# Altium schematic sheet System_Power.SchDoc
size A3; SheetNumber: 2; SheetTotal: 8
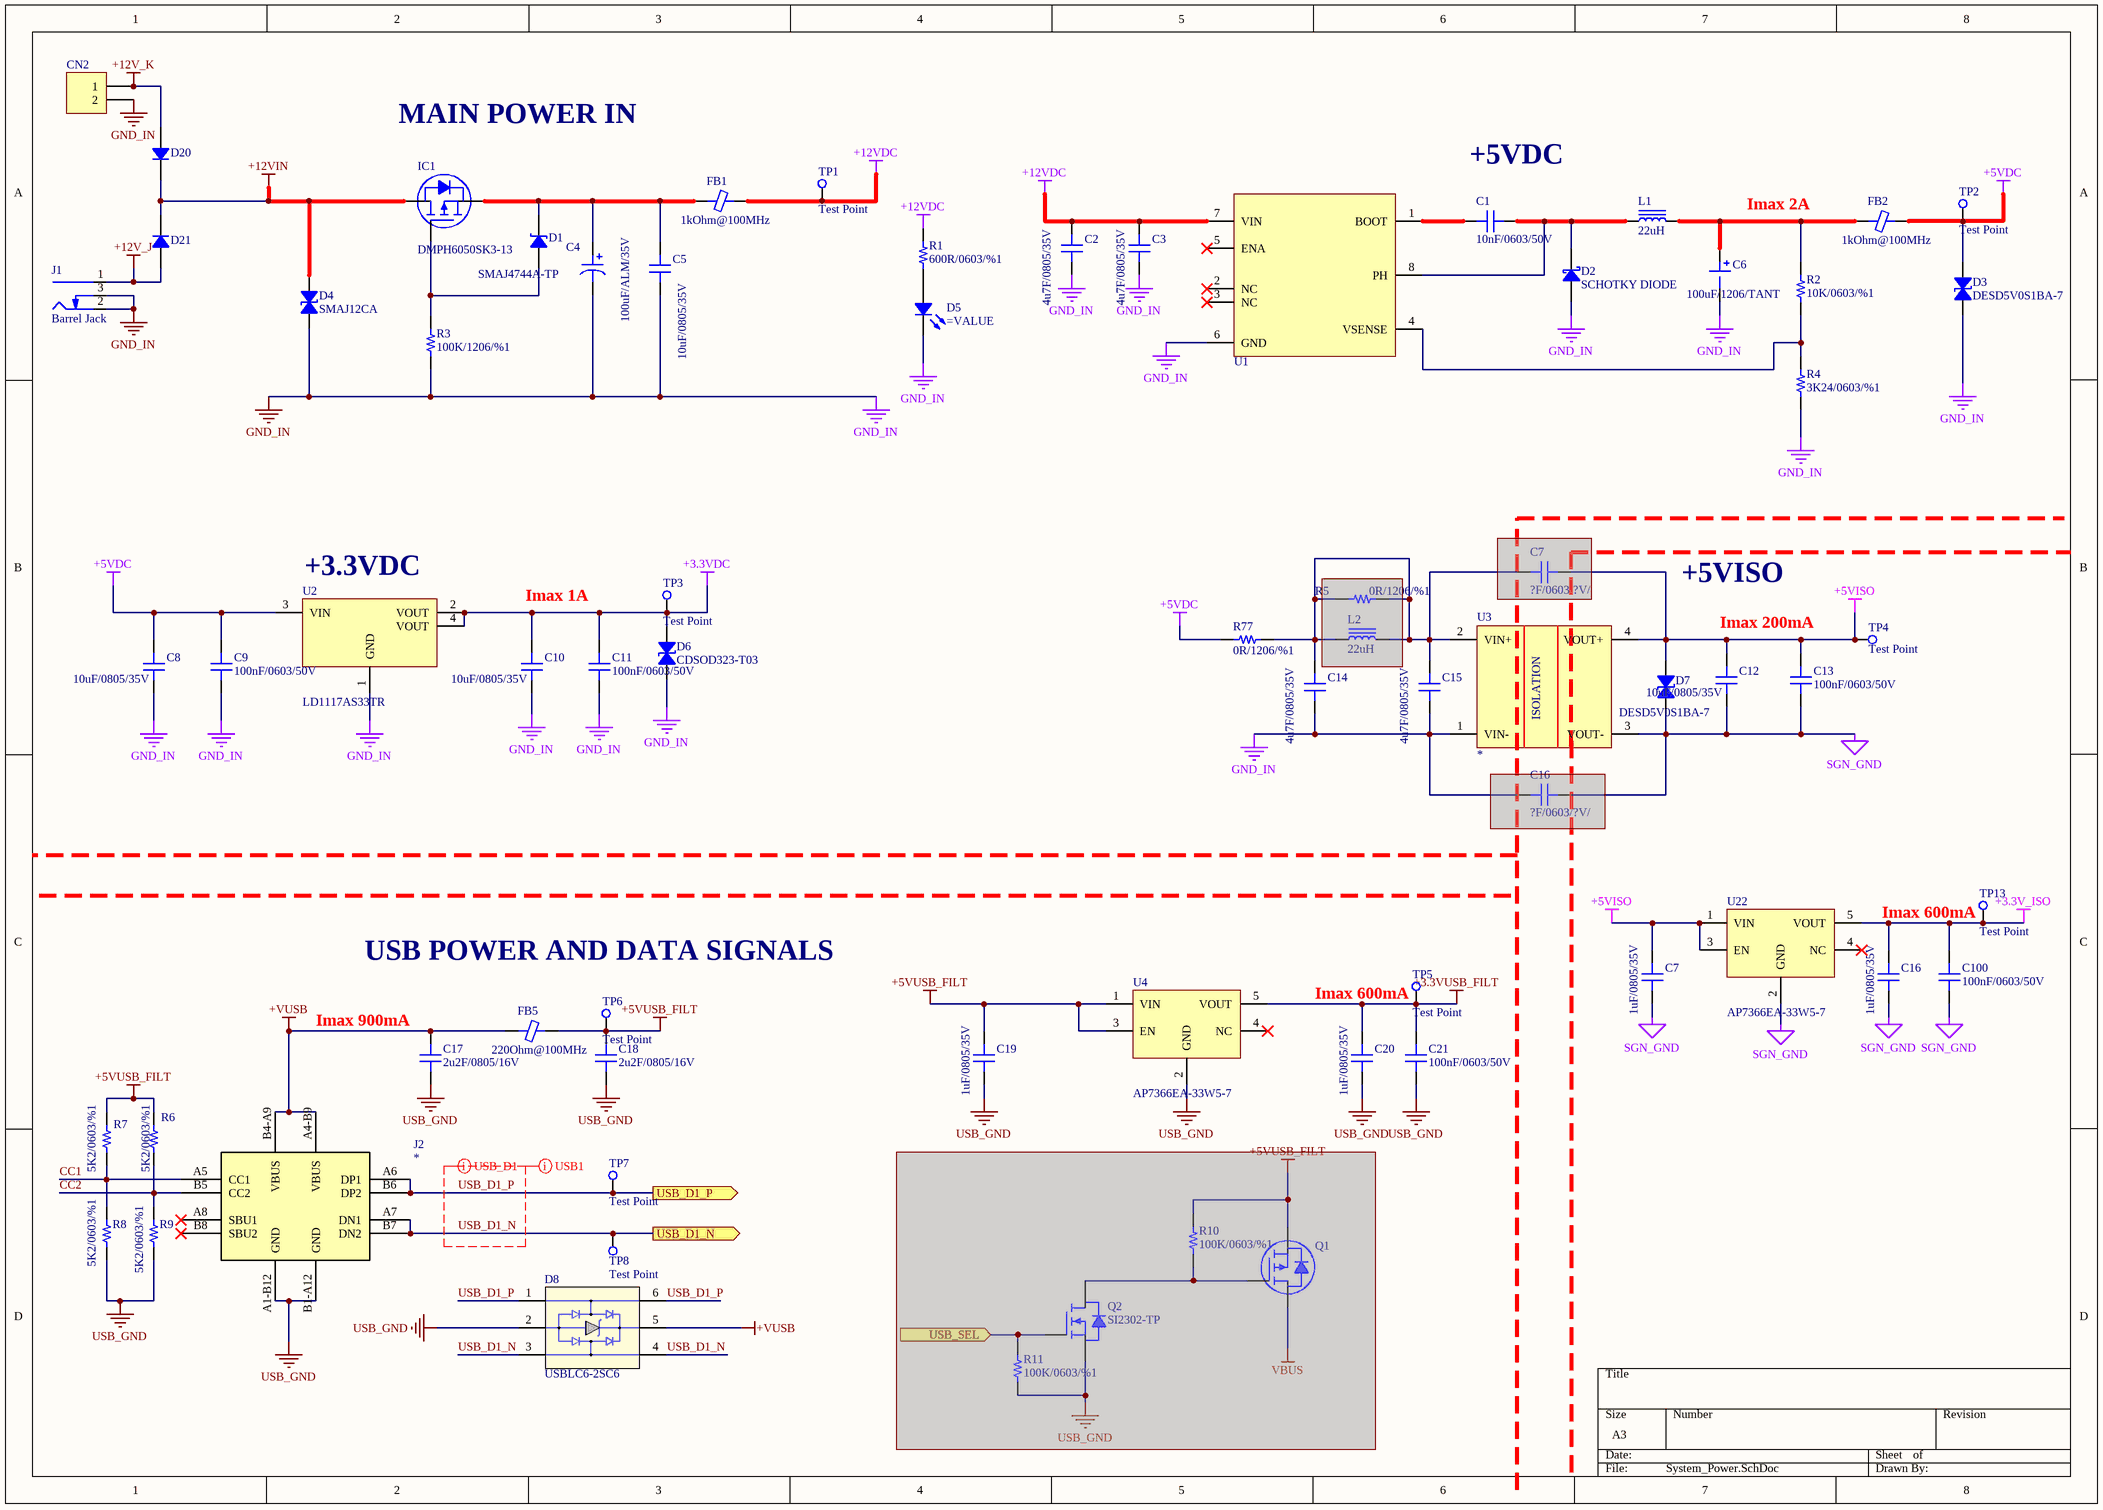
[diagram p0: System_Power.SchDoc]

## Parts
(Parts that share a designator on the sheet are numbered #1, #2 ... from top to bottom, then left to right.)
C1  10nF/0603/50V  [0603_cap]
C2  4u7F/0805/35V  [0805_cap]
C3  4u7F/0805/35V  [0805_cap]
C4  100uF/ALM/35V  [CAP ALSMD 6.6MM]
C5  10uF/0805/35V  [0805_cap]
C6  100uF/1206/TANT  [CAP POL 1206_3216]
C7#1  ?F/0603/?V/  [0402_cap]  (masked out: inside a compile mask, not in the netlist)
C7#2  1uF/0805/35V  [0805_cap]
C8  10uF/0805/35V  [0805_cap]
C9  100nF/0603/50V  [0603_cap]
C10  10uF/0805/35V  [0805_cap]
C11  100nF/0603/50V  [0603_cap]
C12  10uF/0805/35V  [0805_cap]
C13  100nF/0603/50V  [0603_cap]
C14  4u7F/0805/35V  [0805_cap]
C15  4u7F/0805/35V  [0805_cap]
C16#1  ?F/0603/?V/  [0402_cap]  (masked out: inside a compile mask, not in the netlist)
C16#2  1uF/0805/35V  [0805_cap]
C17  2u2F/0805/16V  [0805_cap]
C18  2u2F/0805/16V  [0805_cap]
C19  1uF/0805/35V  [0805_cap]
C20  1uF/0805/35V  [0805_cap]
C21  100nF/0603/50V  [0603_cap]
C100  100nF/0603/50V  [0603_cap]
CN2  DG128-5.0-02P-14-00AH  [klemens]  (value not drawn)
D1  SMAJ4744A-TP  [SOD323]
D2  SCHOTKY DIODE  [DO214AC SMA]
D3  DESD5V0S1BA-7  [SOD323]
D4  SMAJ12CA  [SOD323]
D5  (no value)  [LED 0603_1608 GREEN]
D6  CDSOD323-T03  [SOD323]
D7  DESD5V0S1BA-7  [SOD323]
D8  USBLC6-2SC6  [TI SOT-23-6 DBV]
D20  (no value)  [DO214AC SMA]
D21  (no value)  [DO214AC SMA]
FB1  1kOhm@100MHz  [0805_ferrite]
FB2  1kOhm@100MHz  [0805_ferrite]
FB5  220Ohm@100MHz  [0805_ferrite]
IC1  DMPH6050SK3-13  [TO 252]
J1  Barrel Jack  [CUI_PJ-002B]
J2  *  [USB4105_GCT]
L1  22uH  [IND(8.00mm x 8.00mm)]
L2  22uH  [IND(8.00mm x 8.00mm)]  (masked out: inside a compile mask, not in the netlist)
Q1  (no value)  [TI SOT-23-3 DBZ]  (masked out: inside a compile mask, not in the netlist)
Q2  SI2302-TP  [TI SOT-23-3 DBZ]  (masked out: inside a compile mask, not in the netlist)
R1  600R/0603/%1  [0603_res]
R2  10K/0603/%1  [0603_res]
R3  100K/1206/%1  [1206_res]
R4  3K24/0603/%1  [0603_res]
R5  0R/1206/%1  [1206_res]  (masked out: inside a compile mask, not in the netlist)
R6  5K2/0603/%1  [0603_res]
R7  5K2/0603/%1  [0603_res]
R8  5K2/0603/%1  [0603_res]
R9  5K2/0603/%1  [0603_res]
R10  100K/0603/%1  [0603_res]  (masked out: inside a compile mask, not in the netlist)
R11  100K/0603/%1  [0603_res]  (masked out: inside a compile mask, not in the netlist)
R77  0R/1206/%1  [0603_res]
TP1  Test Point  [tp]
TP2  Test Point  [tp]
TP3  Test Point  [tp]
TP4  Test Point  [tp]
TP5  Test Point  [tp]
TP6  Test Point  [tp]
TP7  Test Point  [tp]
TP8  Test Point  [tp]
TP13  Test Point  [tp]
U1  *  [SOIC-8(3.90MM)]  (value not drawn)
U2  LD1117AS33TR  [SOT-223]
U3  *  [SIP4]
U4  AP7366EA-33W5-7  [SOT25]
U22  AP7366EA-33W5-7  [SOT25]

## Ports
USB_D1_N (out, see Main[2A], USB_Isolation[1D]), USB_D1_P (out, see Main[2A], USB_Isolation[1D]), USB_SEL (in, see Main[2A], USB_Isolation[2A])

## Nets
+3.3V_ISO: C16#2.2 C100.2 TP13.1(TP) U22.5(VOUT)
+3.3VDC: C10.2 C11.2 D6.2 TP3.1(TP) U2.2(VOUT) U2.4(VOUT)
+3.3VUSB_FILT: C20.2 C21.2 TP5.1(TP) U4.5(VOUT)
+5VDC: C8.2 C9.2 D3.2 FB2.2 R77.2 TP2.1(TP) U2.3(VIN)
+5VISO: C7#2.2 C12.2 C13.2 D7.2 TP4.1(TP) U3.4(VOUT+) U22.1(VIN) U22.3(EN)
+5VUSB_FILT: C18.2 C19.2 FB5.2 R6.2 R7.2 TP6.1(TP) U4.1(VIN) U4.3(EN)
+12V_J: D21.1 J1.1(Centre)
+12V_K: CN2.1 D20.1
+12VDC: C2.2 C3.2 FB1.2 R1.2 TP1.1(TP) U1.7(VIN)
+12VIN: D4.2 D20.2 D21.2 IC1.D
+VUSB: C17.2 D8.5 FB5.1 J2.A4-B9(VBUS) J2.B4-A9(VBUS)
GND_IN: C2.1 C3.1 C4.1 C5.1 C6.2 C8.1 C9.1 C10.1 C11.1 C14.1 C15.1 CN2.2 D2.2 D3.1 D4.1 D5.2 D6.1 J1.2(Outer) J1.3(SW) R3.1 R4.1 U1.6(GND) U2.1(GND) U3.1(VIN-)
SGN_GND: C7#2.1 C12.1 C13.1 C16#2.1 C100.1 D7.1 U3.3(VOUT-) U22.2(GND)
USB_GND: C17.1 C18.1 C19.1 C20.1 C21.1 D8.2 J2.A1-B12(GND) J2.B1-A12(GND) R8.1 R9.1 U4.2(GND)
CC1: J2.A5(CC1) R7.1 R8.2
CC2: J2.B5(CC2) R6.1 R9.2
USB_D1_N: D8.3 D8.4 J2.A7(DN1) J2.B7(DN2) TP8.1(TP) ; port USB_D1_N
USB_D1_P: D8.1 D8.6 J2.A6(DP1) J2.B6(DP2) TP7.1(TP) ; port USB_D1_P
NetC1_1: C1.1 D2.1 L1.1 U1.8(PH)
NetC1_2: C1.2 U1.1(BOOT)
NetC4_2: C4.2 C5.2 D1.2 FB1.1 IC1.S
NetC6_1: C6.1 FB2.1 L1.2 R2.2
NetC14_2: C14.2 C15.2 R77.1 U3.2(VIN+)
NetD1_1: D1.1 IC1.G R3.2
NetD5_1: D5.1 R1.1
NetR2_1: R2.1 R4.2 U1.4(VSENSE)

Not connected (* = marked no-connect by the designer): J2 A8(SBU1)* B8(SBU2)*; U1 2(NC)* 3(NC)* 5(ENA)*; U4 4(NC)*; U22 4(NC)*

## Layout directives
mark named USB1: USB_D1_N, USB_D1_P
differential pair: USB_D1_N, USB_D1_P

## Notes on the sheet
- MAIN POWER IN
- (near C1) +5VDC
- Imax 2A
- (near U2) +3.3VDC
- +5VISO
- Imax 1A
- Imax 200mA
- (near TP13) Imax 600mA
- USB POWER AND DATA SIGNALS
- (near C17) Imax 900mA
- (near TP5) Imax 600mA
- (in symbol RFM-0505S) ISOLATION

## Library data of the parts
C1-C3 C5 C7#1 C7#2 C8-C15 C16#1 C16#2 C17-C21 C100 = Capacitor: HelpURL: *; PN: *; Assembly: *
  C1: Value: 10nF/0603/50V
  C2 C3 C14 C15: Value: 4u7F/0805/35V
  C5 C8 C10 C12: Value: 10uF/0805/35V
  C7#1 C16#1: Value: ?F/0603/?V/
  C7#2 C16#2 C19 C20: Value: 1uF/0805/35V
  C9 C11 C13 C21 C100: Value: 100nF/0603/50V
  C17 C18: Value: 2u2F/0805/16V
C4 = Polarised Capacitor IPC: SMT Polarised Capacitor
C6 = tantalcap: MFC PN: TLJA107M010R1400; Assembly: *; Help URL: *; Manufacturer: *; Value: 100uF/1206/TANT
CN2 = klemens_2p: Value: DG128-5.0-02P-14-00AH; Parameter 2: DG128-5.0-02P-14-00AH; Parameter 3: DG128-5.0-02P-14-00AH
D1 = Diode Zener: Zener Diode; Assembly: .; Value: SMAJ4744A-TP; HelpURL: https://www.digikey.com/en/products/detail/mcc-micro-commercial-components/SMAJ4744A-TP/950471?s=N4IgTCBcDaIMoFkCCApALAdjWpBaAKgAogC6AvkA; PN: SMAJ4744A-TP
D2 = SCHOTKY DIODE: Value: B340AE-13; Assembly: .; PN: B340AE-13; HelpURL: https://www.digikey.com/en/products/detail/diodes-incorporated/B340AE-13/7352831
D3 D4 D6 D7 = TVS BI: Zener Diode; Assembly: .
  D3 D7: HelpURL: https://www.digikey.com/en/products/detail/diodes-incorporated/DESD5V0S1BA-7/3451477?s=N4IgTCBcDaICIFEDKcCsA1ADEgjAIQEEBaAdhAF0BfIA; PN: DESD5V0S1BA-7; Value: DESD5V0S1BA-7
  D4: HelpURL: https://www.digikey.com/en/products/detail/bourns-inc/SMAJ12CA/2254385; PN: SMAJ12CA; Value: SMAJ12CA
  D6: HelpURL: https://www.digikey.com/en/products/detail/bourns-inc/CDSOD323-T03/3742076; PN: CDSOD323-T03; Value: CDSOD323-T03
D5 = LED: Chip LED
D8 = USBLC6-2SC6: 17V Clamp 5A (8/20µs) Ipp Tvs Diode Surface Mount SOT-23-6; Assembly: .; Value: USBLC6-2SC6; PN: USBLC6-2SC6; HelpURL: https://www.digikey.com/en/products/detail/stmicroelectronics/USBLC6-2SC6/1040559
D20 D21 = Diode: Rectifier Diode
FB1 FB2 FB5 = Ferrite Chip: SMT Ferrite Chip
IC1 = P-CHN MOS: Assembly: .; Value: DMPH6050SK3-13; HelpURL: https://www.digikey.com/en/products/detail/diodes-incorporated/DMPH6050SK3-13/6010147; PN: DMPH6050SK3-13
J1 = Barrel Connector: Value: PJ-002B; Assembly: .; PN: PJ-002B; HelpURL: https://www.digikey.com/en/products/detail/same-sky-formerly-cui-devices/PJ-002B/96965
J2 = USB2.0 TYP C: No Description Available; Value: *; HelpURL: *; PN: *; Assembly: *
L1 L2 = Inductor: SMT Inductor; PN: SRN8040TA-220M; Assembly: .; Value: 22uH; HelpURL: https://www.digikey.com/en/products/detail/bourns-inc/SRN8040TA-220M/6155131
Q1 = P-CHN MOS SOT: MOSFET P-CH 20V 4.2A SOT23; Value: DMG2305UX-7; Assembly: .; PN: DMG2305UX-7; Help URL: https://www.digikey.com/en/products/detail/diodes-incorporated/DMG2305UX-7/4340667
Q2 = N-CHN MOS SOT: MOSFET N-CH 20V 3A SOT-23; Assembly: .; Help URL: https://www.digikey.com/en/products/detail/mcc-micro-commercial-components/SI2302-TP/1793243; PN: SI2302-TP; Value: SI2302-TP
R1-R11 R77 = RES: Assembly: .; HelpURL: *; PN: *
  R1: Value: 600R/0603/%1
  R2: Value: 10K/0603/%1
  R3: Value: 100K/1206/%1
  R4: Value: 3K24/0603/%1
  R5 R77: Value: 0R/1206/%1
  R6-R9: Value: 5K2/0603/%1
  R10 R11: Value: 100K/0603/%1
U1 = TPS5420xx: Assembly: *; HelpURL: *; PN: *; Value: *
U2 = LD1117: Wide Temperature Three-Pin Adjustable Regulator; Assembly: .; Value: LD1117AS33TR; PN: LD1117AS33TR; HelpURL: https://www.digikey.com/en/products/detail/stmicroelectronics/LD1117AS33TR/585752
U3 = RFM-0505S: Value: *; HelpURL: *; PN: *; Assembly: *
U4 U22 = AP7366EA-33W5-7: IC REG LINEAR 3.3V 600MA SOT-25; Assembly: .; PN: AP7366EA-33W5-7; HelpURL: https://www.digikey.com/en/products/detail/diodes-incorporated/AP7366EA-33W5-7/18635685?s=N4IgTCBcDaIIIAUDsBmAbGgonAtClA6gKw5IgC6AvkA; Value: AP7366EA-33W5-7